# EAGLE schematic main_board_v0001 (EAGLE 6.4)
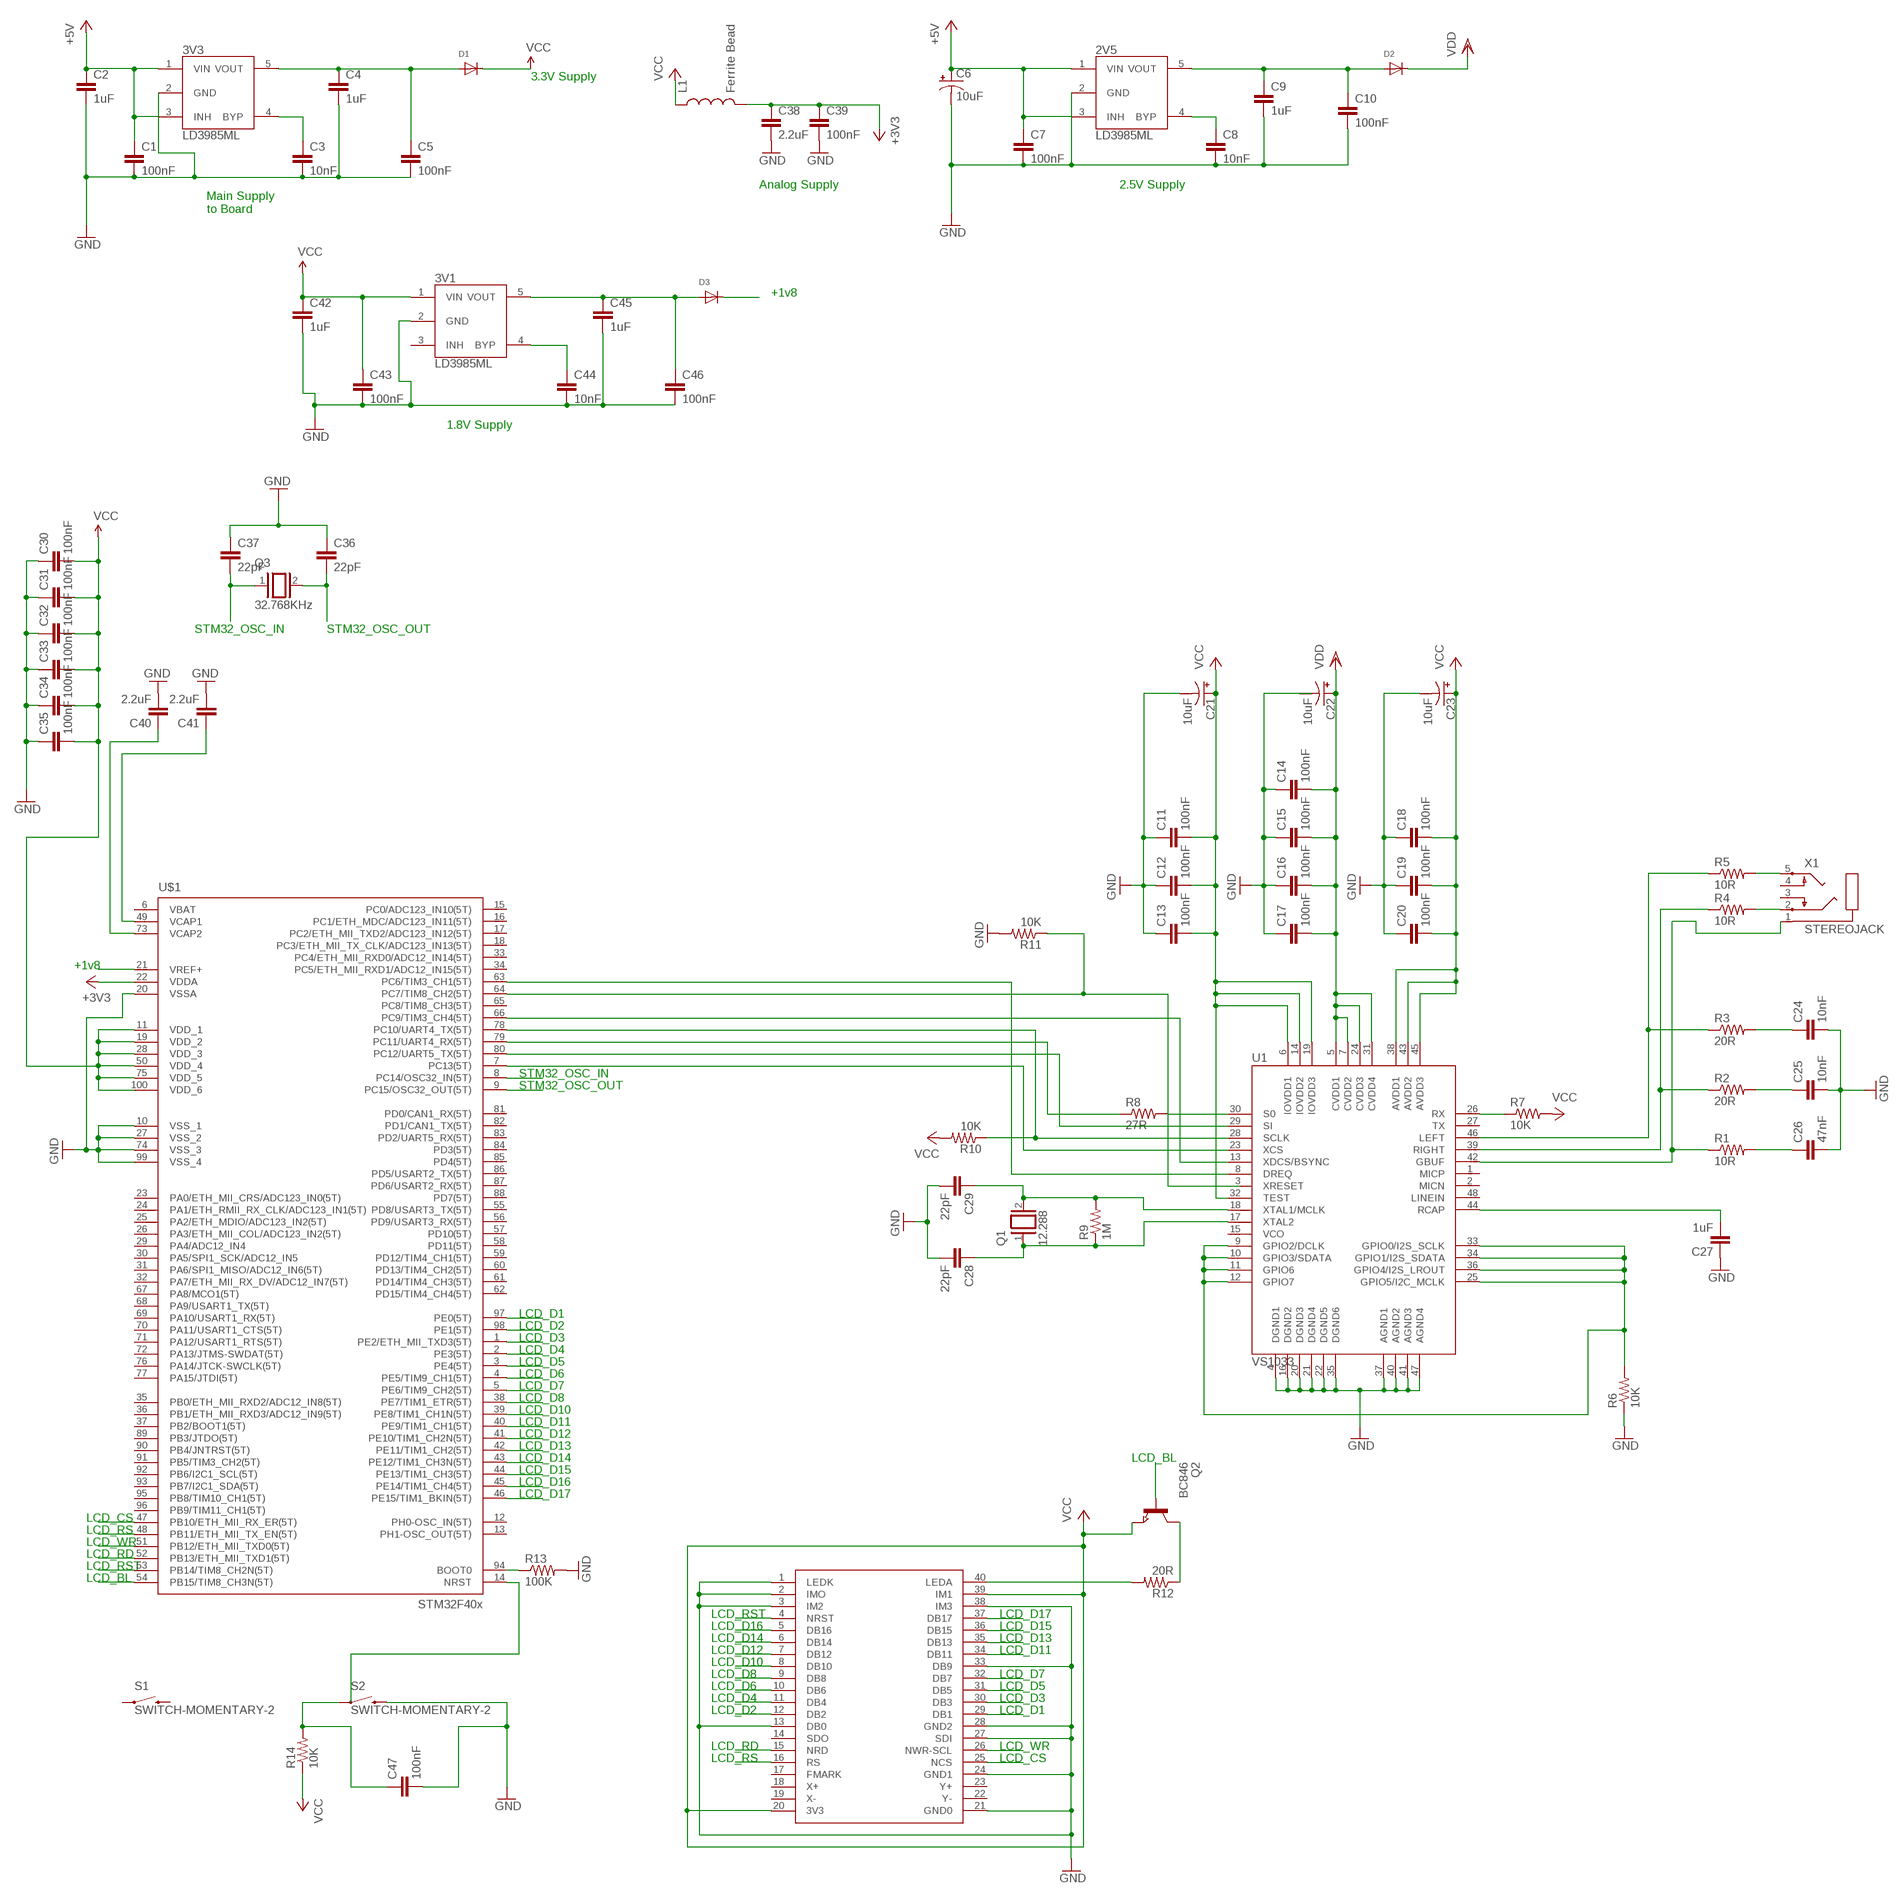
[diagram p0: schematic, sheet 1]

## Parts
2V5  LD3985ML  [SOT-23-5L]
3V1  LD3985ML  [SOT-23-5L]
3V3  LD3985ML  [SOT-23-5L]
C1  100nF  C-EUC1005  [C1005]
C2  1uF  C-EUC0603  [C0603]
C3  10nF  C-EUC0603  [C0603]
C4  1uF  C-EUC0603  [C0603]
C5  100nF  C-EUC1005  [C1005]
C6  10uF  CAP_POL3528-KIT  [EIA3528-KIT]
C7  100nF  C-EUC1005  [C1005]
C8  10nF  C-EUC0603  [C0603]
C9  1uF  C-EUC0603  [C0603]
C10  100nF  C-EUC1005  [C1005@1]
C11  100nF  C-EUC0603  [C0603]
C12  100nF  C-EUC0603  [C0603]
C13  100nF  C-EUC0603  [C0603]
C14  100nF  C-EUC0603  [C0603]
C15  100nF  C-EUC0603  [C0603]
C16  100nF  C-EUC0603  [C0603]
C17  100nF  C-EUC0603  [C0603]
C18  100nF  C-EUC0603  [C0603]
C19  100nF  C-EUC0603  [C0603]
C20  100nF  C-EUC0603  [C0603]
C21  10uF  CAP_POL3528-KIT  [EIA3528-KIT]
C22  10uF  CAP_POL3528-KIT  [EIA3528-KIT]
C23  10uF  CAP_POL3528-KIT  [EIA3528-KIT]
C24  10nF  C-EUC0603  [C0603]
C25  10nF  C-EUC0603  [C0603]
C26  47nF  C-EUC0603  [C0603]
C27  1uF  C-EUC0603  [C0603]
C28  22pF  C-EUC0603  [C0603]
C29  22pF  C-EUC0603  [C0603]
C30  100nF  C-EUC1005  [C1005]
C31  100nF  C-EUC1005  [C1005]
C32  100nF  C-EUC1005  [C1005]
C33  100nF  C-EUC1005  [C1005]
C34  100nF  C-EUC1005  [C1005]
C35  100nF  C-EUC1005  [C1005]
C36  22pF  C-EUC1005  [C1005]
C37  22pF  C-EUC1005  [C1005]
C38  2.2uF  C-EUC1005  [C1005]
C39  100nF  C-EUC1005  [C1005]
C40  2.2uF  C-EUC1005  [C1005]
C41  2.2uF  C-EUC1005  [C1005]
C42  1uF  C-EUC0603  [C0603]
C43  100nF  C-EUC1005  [C1005]
C44  10nF  C-EUC0603  [C0603]
C45  1uF  C-EUC0603  [C0603]
C46  100nF  C-EUC1005  [C1005]
C47  100nF  C-EUC0603  [C0603]
D1  DIODESOD-323F  [SOD-323F]
D2  DIODESOD-323F  [SOD-323F]
D3  DIODESOD-323F  [SOD-323F]
L1  Ferrite Bead  INDUCTOR0402  [C0402]
Q1  12.288  XTAL/S  [QS]
Q2  BC846  NPN-TRANSISTOR_SOT23  [SOT23]
Q3  32.768KHz  XTAL/S  [QS]
R1  10R  R-US_M0805  [M0805]
R2  20R  R-US_M0805  [M0805]
R3  20R  R-US_M0805  [M0805]
R4  10R  R-US_M0805  [M0805]
R5  10R  R-US_M0805  [M0805]
R6  10K  R-US_M0805  [M0805]
R7  10K  R-US_M0805  [M0805]
R8  27R  R-US_M0805  [M0805]
R9  1M  R-US_M0805  [M0805]
R10  10K  R-US_M0805  [M0805]
R11  10K  R-US_M0805  [M0805]
R12  20R  R-US_M0805  [M0805]
R13  100K  R-US_M0805  [M0805]
R14  10K  R-US_M0805  [M0805]
S1  SWITCH-MOMENTARY-2  [TACTILE_SWITCH_TALL]
S2  SWITCH-MOMENTARY-2  [TACTILE_SWITCH_TALL]
U1  VS1033  [LQFP-48]
U$1  STM32F407V  [TQFP100]
U$2  MIKROE-PROTO-ILI9341  [2X20-PINHEAD]
X1  STEREOJACK  [STX3100]

## Nets
+1V8: D3.C U$1.21(VREF+)
+3V3: C38.1 C39.1 L1.2 U$1.22(VDDA)
+5V: 2V5.1(VIN) 2V5.3(INH) 3V3.1(VIN) 3V3.3(INH) C1.1 C2.1 C6.A(+) C7.1
GND: 2V5.2(GND) 3V1.2(GND) 3V3.2(GND) C1.2 C2.2 C3.2 C4.2 C5.2 C6.C(-) C7.2 C8.2 C9.2 C10.2 C11.1 C12.1 C13.1 C14.1 C15.1 C16.1 C17.1 C18.1 C19.1 C20.1 C21.C(-) C23.C(-) C24.2 C25.2 C26.2 C27.1 C28.2 C29.2 C30.1 C31.1 C32.1 C33.1 C34.1 C35.1 C36.1 C37.1 C38.2 C39.2 C40.2 C41.2 C42.2 C43.2 C44.2 C45.2 C46.2 C47.2 R6.1 R11.2 R13.2 S2.B2 U1.4(DGND1) U1.16(DGND2) U1.20(DGND3) U1.21(DGND4) U1.22(DGND5) U1.35(DGND6) U1.37(AGND1) U1.40(AGND2) U1.41(AGND3) U1.47(AGND4) U$1.10(VSS_1) U$1.20(VSSA) U$1.27(VSS_2) U$1.74(VSS_3) U$1.99(VSS_4) U$2.1(LEDK) U$2.2(IMO) U$2.3(IM2) U$2.13(DB0) U$2.21(GND0) U$2.24(GND1) U$2.27(SDI) U$2.28(GND2) U$2.33(DB9) U$2.38(IM3)
LCD_BL: Q2.1(B) U$1.54(PB15/TIM8_CH3N(5T))
LCD_CS: U$1.47(PB10/ETH_MII_RX_ER(5T)) U$2.25(NCS)
LCD_D1: U$1.97(PE0(5T)) U$2.29(DB1)
LCD_D2: U$1.98(PE1(5T)) U$2.12(DB2)
LCD_D3: U$1.1(PE2/ETH_MII_TXD3(5T)) U$2.30(DB3)
LCD_D4: U$1.2(PE3(5T)) U$2.11(DB4)
LCD_D5: U$1.3(PE4(5T)) U$2.31(DB5)
LCD_D6: U$1.4(PE5/TIM9_CH1(5T)) U$2.10(DB6)
LCD_D7: U$1.5(PE6/TIM9_CH2(5T)) U$2.32(DB7)
LCD_D8: U$1.38(PE7/TIM1_ETR(5T)) U$2.9(DB8)
LCD_D10: U$1.39(PE8/TIM1_CH1N(5T)) U$2.8(DB10)
LCD_D11: U$1.40(PE9/TIM1_CH1(5T)) U$2.34(DB11)
LCD_D12: U$1.41(PE10/TIM1_CH2N(5T)) U$2.7(DB12)
LCD_D13: U$1.42(PE11/TIM1_CH2(5T)) U$2.35(DB13)
LCD_D14: U$1.43(PE12/TIM1_CH3N(5T)) U$2.6(DB14)
LCD_D15: U$1.44(PE13/TIM1_CH3(5T)) U$2.36(DB15)
LCD_D16: U$1.45(PE14/TIM1_CH4(5T)) U$2.5(DB16)
LCD_D17: U$1.46(PE15/TIM1_BKIN(5T)) U$2.37(DB17)
LCD_RD: U$1.52(PB13/ETH_MII_TXD1(5T)) U$2.15(NRD)
LCD_RS: U$1.48(PB11/ETH_MII_TX_EN(5T)) U$2.16(RS)
LCD_RST: U$1.53(PB14/TIM8_CH2N(5T)) U$2.4(NRST)
LCD_WR: U$1.51(PB12/ETH_MII_TXD0(5T)) U$2.26(NWR-SCL)
N$1: 2V5.5(VOUT) C9.1 C10.1 D2.A
N$2: R1.1 U1.42(GBUF) X1.1
N$3: 2V5.4(BYP) C8.1
N$4: 3V3.4(BYP) C3.1
N$5: R2.1 R4.1 U1.39(RIGHT)
N$6: 3V3.5(VOUT) C4.1 C5.1 D1.A
N$7: R3.1 R5.1 U1.46(LEFT)
N$8: C26.1 R1.2
N$9: C25.1 R2.2
N$10: C24.1 R3.2
N$11: R4.2 X1.2
N$12: R5.2 X1.5
N$13: R8.2 U1.30(S0)
N$14: C27.2 U1.44(RCAP)
N$15: R6.2 U1.9(GPIO2/DCLK) U1.10(GPIO3/SDATA) U1.11(GPIO6) U1.12(GPIO7) U1.25(GPIO5/I2C_MCLK) U1.33(GPIO0/I2S_SCLK) U1.34(GPIO1/I2S_SDATA) U1.36(GPIO4/I2S_LROUT)
N$16: R7.1 U1.26(RX)
N$17: R10.1 U1.28(SCLK) U$1.78(PC10/UART4_TX(5T))
N$18: R8.1 U$1.79(PC11/UART4_RX(5T))
N$19: U1.29(SI) U$1.80(PC12/UART5_TX(5T))
N$20: U1.23(XCS) U$1.7(PC13(5T))
N$21: U1.13(XDCS/BSYNC) U$1.66(PC9/TIM3_CH4(5T))
N$22: R11.1 U$1.64(PC7/TIM8_CH2(5T))
N$23: U1.8(DREQ) U$1.63(PC6/TIM3_CH1(5T))
N$24: C28.1 Q1.1 R9.1 U1.17(XTAL2)
N$25: C29.1 Q1.2 R9.2 U1.18(XTAL1/MCLK)
N$26: C40.1 U$1.73(VCAP2)
N$27: Q2.3(C) R12.1
N$28: R12.2 U$2.40(LEDA)
N$29: C41.1 U$1.49(VCAP1)
N$30: R13.1 U$1.94(BOOT0)
N$31: U$1.14(NRST)
N$32: 3V1.4(BYP) C44.1
N$33: C47.1 R14.2 S2.A2
N$34: 3V1.5(VOUT) C45.1 C46.1 D3.A
STM32_OSC_IN: C37.2 Q3.1 U$1.8(PC14/OSC32_IN(5T))
STM32_OSC_OUT: C36.2 Q3.2 U$1.9(PC15/OSC32_OUT(5T))
VCC: 3V1.1(VIN) C11.2 C12.2 C13.2 C18.2 C19.2 C20.2 C21.A(+) C23.A(+) C30.2 C31.2 C32.2 C33.2 C34.2 C35.2 C42.1 C43.1 D1.C L1.1 Q2.2(E) R7.2 R10.2 R14.1 U1.6(IOVDD1) U1.14(IOVDD2) U1.19(IOVDD3) U1.32(TEST) U1.38(AVDD1) U1.43(AVDD2) U1.45(AVDD3) U$1.11(VDD_1) U$1.19(VDD_2) U$1.28(VDD_3) U$1.50(VDD_4) U$1.75(VDD_5) U$1.100(VDD_6) U$2.20(3V3) U$2.39(IM1)
VDD: C14.2 C15.2 C16.2 C17.2 C22.A(+) D2.C U1.5(CVDD1) U1.7(CVDD2) U1.24(CVDD3) U1.31(CVDD4)
Unconnected: 3V1.3(INH) C22.C(-) S1.A2 S1.B2 U1.1(MICP) U1.2(MICN) U1.3(XRESET) U1.15(VCO) U1.27(TX) U1.48(LINEIN) U$1.6(VBAT) U$1.12(PH0-OSC_IN(5T)) U$1.13(PH1-OSC_OUT(5T)) U$1.15(PC0/ADC123_IN10(5T)) U$1.16(PC1/ETH_MDC/ADC123_IN11(5T)) U$1.17(PC2/ETH_MII_TXD2/ADC123_IN12(5T)) U$1.18(PC3/ETH_MII_TX_CLK/ADC123_IN13(5T)) U$1.23(PA0/ETH_MII_CRS/ADC123_IN0(5T)) U$1.24(PA1/ETH_RMII_RX_CLK/ADC123_IN1(5T)) U$1.25(PA2/ETH_MDIO/ADC123_IN2(5T)) U$1.26(PA3/ETH_MII_COL/ADC123_IN2(5T)) U$1.29(PA4/ADC12_IN4) U$1.30(PA5/SPI1_SCK/ADC12_IN5) U$1.31(PA6/SPI1_MISO/ADC12_IN6(5T)) U$1.32(PA7/ETH_MII_RX_DV/ADC12_IN7(5T)) U$1.33(PC4/ETH_MII_RXD0/ADC12_IN14(5T)) U$1.34(PC5/ETH_MII_RXD1/ADC12_IN15(5T)) U$1.35(PB0/ETH_MII_RXD2/ADC12_IN8(5T)) U$1.36(PB1/ETH_MII_RXD3/ADC12_IN9(5T)) U$1.37(PB2/BOOT1(5T)) U$1.55(PD8/USART3_TX(5T)) U$1.56(PD9/USART3_RX(5T)) U$1.57(PD10(5T)) U$1.58(PD11(5T)) U$1.59(PD12/TIM4_CH1(5T)) U$1.60(PD13/TIM4_CH2(5T)) U$1.61(PD14/TIM4_CH3(5T)) U$1.62(PD15/TIM4_CH4(5T)) U$1.65(PC8/TIM8_CH3(5T)) U$1.67(PA8/MCO1(5T)) U$1.68(PA9/USART1_TX(5T)) U$1.69(PA10/USART1_RX(5T)) U$1.70(PA11/USART1_CTS(5T)) U$1.71(PA12/USART1_RTS(5T)) U$1.72(PA13/JTMS-SWDAT(5T)) U$1.76(PA14/JTCK-SWCLK(5T)) U$1.77(PA15/JTDI(5T)) U$1.81(PD0/CAN1_RX(5T)) U$1.82(PD1/CAN1_TX(5T)) U$1.83(PD2/UART5_RX(5T)) U$1.84(PD3(5T)) U$1.85(PD4(5T)) U$1.86(PD5/USART2_TX(5T)) U$1.87(PD6/USART2_RX(5T)) U$1.88(PD7(5T)) U$1.89(PB3/JTDO(5T)) U$1.90(PB4/JNTRST(5T)) U$1.91(PB5/TIM3_CH2(5T)) U$1.92(PB6/I2C1_SCL(5T)) U$1.93(PB7/I2C1_SDA(5T)) U$1.95(PB8/TIM10_CH1(5T)) U$1.96(PB9/TIM11_CH1(5T)) U$2.14(SDO) U$2.17(FMARK) U$2.18(X+) U$2.19(X-) U$2.22(Y-) U$2.23(Y+) X1.3 X1.4

## Notes on the sheet
- 3.3V Supply
- Analog Supply | 2.5V Supply
- Main Supply
  to Board
- +1v8
- 1.8V Supply
- STM32_OSC_IN | STM32_OSC_OUT
- +1v8
- STM32_OSC_IN
- STM32_OSC_OUT
- LCD_D1
- LCD_D2
- LCD_D3
- LCD_D4
- LCD_D5
- LCD_D6
- LCD_D7
- LCD_D8
- LCD_D10
- LCD_D11
- LCD_D12
- LCD_D13
- LCD_D14 | LCD_BL
- LCD_D15
- LCD_D16
- LCD_D17
- LCD_CS
- LCD_RS
- LCD_WR
- LCD_RD
- LCD_RST
- LCD_BL
- LCD_RST | LCD_D17
- LCD_D16 | LCD_D15
- LCD_D14 | LCD_D13
- LCD_D12 | LCD_D11
- LCD_D10
- LCD_D8 | LCD_D7
- LCD_D6 | LCD_D5
- LCD_D4 | LCD_D3
- LCD_D2 | LCD_D1
- LCD_RD | LCD_WR
- LCD_RS | LCD_CS

## Library data of the parts
2V5 3V1 3V3 = LD3985M:LD3985M
C1 C5 C7 C30-C41 C43 C46 = resistor:C-EU: CAPACITOR, European symbol
C2-C4 C8-C20 C24-C29 C42 C44 C45 C47 = rcl:C-EU: CAPACITOR, European symbol
C6 C21-C23 = SparkFun-Capacitors:CAP_POL: Capacitor Polarized These are standard SMD and PTH capacitors. Normally 10uF, 47uF, and 100uF in electrolytic and tantalum varieties. Always verify the external diameter of the through hole cap, it varies with capacity, voltage, and manufacturer. The EIA devices should be standard.
D1-D3 = adafruit:DIODE: Diode SMADIODE - SMA Surface Mount Package 20V 1A Schottky Diode Digikey: 641-1014-6-ND DO-1N4148 - Through Hole Small Current Diode SOD-123 20V 1 A (.5mV Vf) Schottky Diode - Digikey: MBRX120TPMSCT-ND SOD-323 10V 570mA (.38mV Vf, 3ns) Schottky Diode - Digikey: ZLLS410CT-ND SOD-523 30V 30mA Schottky Diode (RB751S-40TE61) - Digikey: RB751S-40TE61CT-ND SOT23-R/W - SOT23 Package (R = Solder Paste/Reflow Ovens, W = Hand-Soldering) BAT54Film 40V 300mA - Digikey: 497-7162-1-ND
L1 = SparkFun-Passives:INDUCTOR: Inductors Basic Inductor/Choke - 0603 and 1206. Footprints are not proven and vary greatly between part numbers. SRN6045- 33uH, 20% 1.4A
Q1 Q3 = special:XTAL/S: CRYSTAL
Q2 = semicon-smd-ipc:NPN-TRANSISTOR_: NPN TRANSISTOR
R1-R14 = resistor:R-US_: RESISTOR, American symbol
S1 S2 = SparkFun-Electromechanical:SWITCH-MOMENTARY-2: Various NO switches- pushbuttons, reed, etc
U1 = SparkFun-DigitalIC:VS1033: MP3 codec
U$1 = stm32f4:STM32F407V: STM32F407 100 pin LQFP reviewed: YES tested: YES
U$2 = tft_multi:MIKROE-PROTO-ILI9341
X1 = adafruit:STEREOJACK: MIC/HEADPHONE JACK Stereo jack with two switches. Kycon STX3100, CUI SJ1-3555NG and/or 4UCon 05544